# Altium schematic sheet main_esp.SchDoc
size A
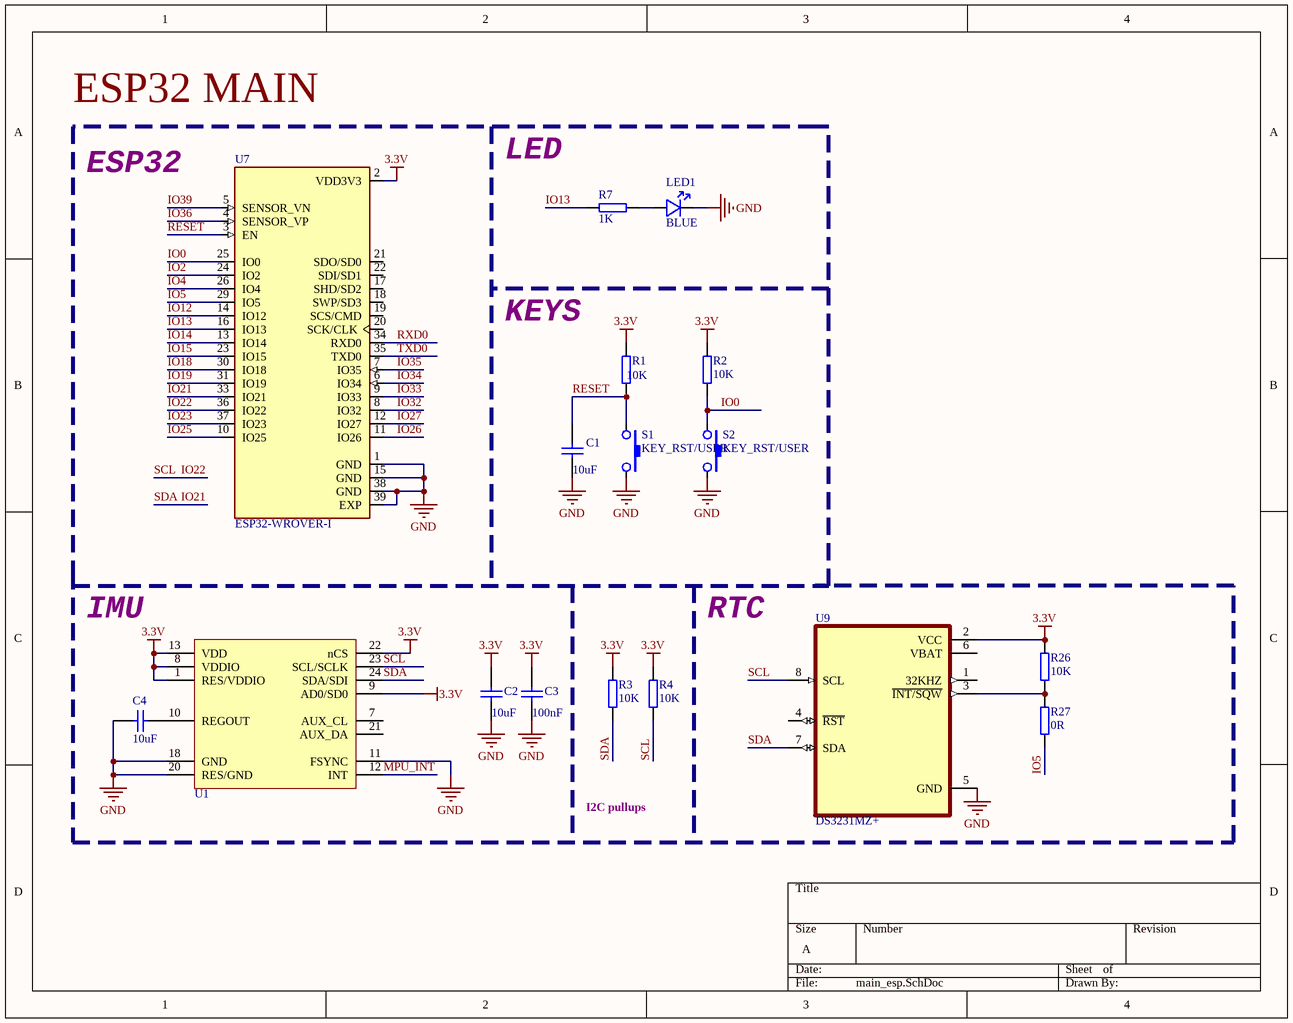
[diagram p0: main_esp.SchDoc]

## Parts
C1  value 10uF  [SMT0603]  (hidden comment: Cap Semi)
C2  value 10uF  [SMT0603]  (hidden comment: Cap Semi)
C3  value 100nF  [SMT0603]  (hidden comment: Cap Semi)
C4  value 10uF  [SMT0603]  (hidden comment: Cap Semi)
LED1  BLUE  [SMT0603P]
R1  value 10K  [SMT0603]  (hidden comment: Resistor)
R2  value 10K  [SMT0603]  (hidden comment: Resistor)
R3  value 10K  [SMT0603]  (hidden comment: Resistor)
R4  value 10K  [SMT0603]  (hidden comment: Resistor)
R7  value 1K  [SMT0603]  (hidden comment: Resistor)
R26  value 10K  [SMT0603]  (hidden comment: Resistor)
R27  value 0R  [SMT0603]  (hidden comment: Resistor)
S1  KEY_RST/USER  [SMT_SW_PTS_820]
S2  KEY_RST/USER  [SMT_SW_PTS_820]
U1  MPU-9250  (value not drawn)
U7  ESP32-WROVER-I  [XCVR_ESP32-WROVER-I]
U9  DS3231MZ+  [SOIC127P600X175-8N]

## Blocks framed on the sheet
ESP32 MAIN: C1 LED1 R1 R2 R7 S1 S2 U7

## Nets
3.3V: C2.2 C3.2 R1.2 R2.2 R3.2 R4.2 R26.1 U1.1(RES/VDDIO) U1.8(VDDIO) U1.9(AD0/SD0) U1.13(VDD) U1.22(nCS) U7.2(VDD3V3) U9.2(VCC)
GND: C1.1 C2.1 C3.1 C4.2 LED1.2 S1.2 S2.2 U1.11(FSYNC) U1.18(GND) U1.20(RES/GND) U7.1(GND) U7.15(GND) U7.38(GND) U7.39(EXP) U9.5(GND)
IO0: R2.1 S2.1 U7.25(IO0)
IO2: U7.24(IO2)
IO4: U7.26(IO4)
IO5: R27.2 U7.29(IO5)
IO12: U7.14(IO12)
IO13: R7.1 U7.16(IO13)
IO14: U7.13(IO14)
IO15: U7.23(IO15)
IO18: U7.30(IO18)
IO19: U7.31(IO19)
IO21: R3.1 U1.24(SDA/SDI) U7.33(IO21) U9.7(SDA)  [also labelled SDA]
IO22: R4.1 U1.23(SCL/SCLK) U7.36(IO22) U9.8(SCL)  [also labelled SCL]
IO23: U7.37(IO23)
IO25: U7.10(IO25)
IO26: U7.11(IO26)
IO27: U7.12(IO27)
IO32: U7.8(IO32)
IO33: U7.9(IO33)
IO34: U7.6(IO34)
IO35: U7.7(IO35)
IO36: U7.4(SENSOR_VP)
IO39: U7.5(SENSOR_VN)
MPU_INT: U1.12(INT)
RESET: C1.2 R1.1 S1.1 U7.3(EN)
RXD0: U7.34(RXD0)
TXD0: U7.35(TXD0)
NetC4_1: C4.1 U1.10(REGOUT)
NetLED1_1: LED1.1 R7.2
NetR26_2: R26.2 R27.1 U9.3(~{INT/SQW})

Not connected (* = marked no-connect by the designer): U1 7(AUX_CL) 21(AUX_DA); U7 17(SHD/SD2) 18(SWP/SD3) 19(SCS/CMD) 20(SCK/CLK) 21(SDO/SD0) 22(SDI/SD1); U9 1(32KHZ) 4(~{RST}) 6(VBAT)

## Notes on the sheet
- LED
- ESP32
- KEYS
- IMU
- RTC
- I2C pullups

## Library data of the parts
C1 C2 C4 = CAP-SM-0603-X5R-10uF: CAP SM 0603 X5R 10uF 10%; Tolerance: ±10%; Supplier 1: Farnell; Supplier 2: Digi-Key; Supplier Part Number 1: 2366833; Supplier Part Number 2: 490-3896-1-ND
C3 = CAP-SM-0603-X7R-100nF: CAP SM 0603 X7R 100nF 10%; Tolerance: ±10%; Supplier 1: Digi-Key; Supplier 2: Farnell; Supplier Part Number 1: 490-3167-1-ND; Supplier Part Number 2: 1775994RL
LED1 = LNJ937W8CRA: LED SM 0603 BLUE 2V9 FWD VOLTAGE; Forward Voltage: 2.9V; Supplier 1: Digi-Key; Supplier Part Number 1: LNJ937W8CRACT-ND
R1-R4 R26 R27 = RES-SM-0603-10K: RES SM 0603 10K; Supplier 1: Farnell; Supplier 2: Digi-Key; Supplier Part Number 1: 9330399; Supplier Part Number 2: 541-10.0KHCT-ND
R7 = RES-SM-0603-1K: RES SM 0603 1K
S1 S2 = SMT_SW_PTS_820: SMT Tactile ‎Switch PTS 820 Series
U7 = ESP32-WROVER-I: Bluetooth, WiFi 802.11b/g/n, Bluetooth v4.2 + EDR, Class 1, 2 and 3 Transceiver Module 2.4GHz ~ 2.5GHz Antenna Not Included, I-PEX Surface Mount; MF: Espressif Systems; Package: Module Espressif Systems; Availability: Unavailable; MP: ESP32-WROVER-I; Value: *; SnapEDA_Link: https://www.snapeda.com/parts/ESP32-WROVER-I/Espressif%20Systems/view-part/2298808/?ref=snap; Price: None
U9 = DS3231MZ+: Real Time Clock _RTC_ IC Clock/Calendar IÂ²C, 2-Wire Serial 8-SOIC _0.154, 3.90mm Width_; MF: Maxim Integrated; MP: DS3231MZ; Price: None; Availability: Unavailable; Package: SOIC-8 Maxim Integrated; SnapEDA_Link: https://www.snapeda.com/parts/DS3231MZ/Maxim%20Integrated/view-part/2834343/?ref=snap; Value: *